# Altium schematic sheet AudioSubsystem.SchDoc: Audio Subsystem
size Letter; DocumentNumber: 4; Revision: 1; SheetNumber: 4; SheetTotal: 6
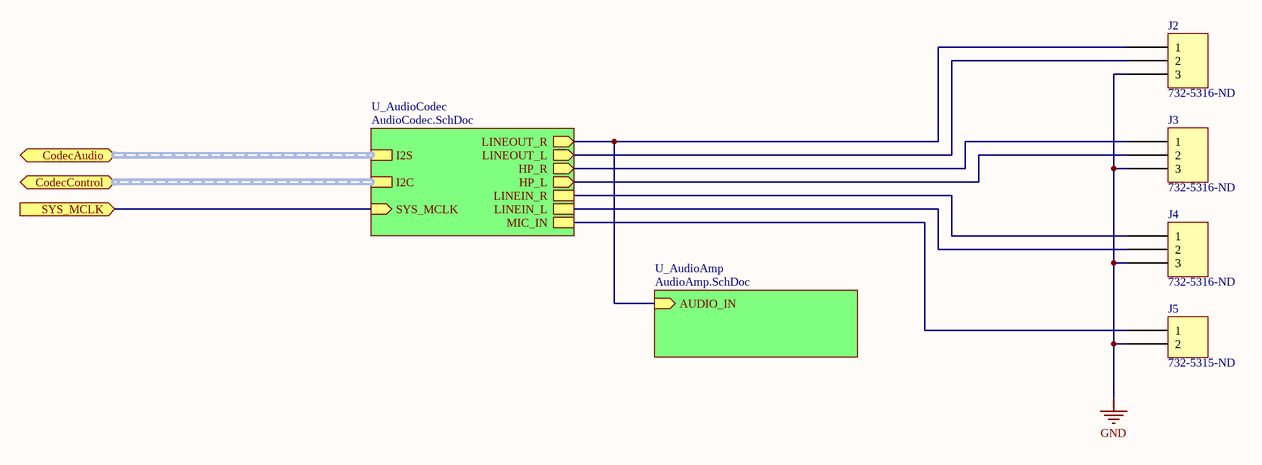
[diagram p0: AudioSubsystem.SchDoc]

## Parts
J2  Supplier Part Number 1: 732-5316-ND  [Pinhead_1x3]  (hidden comment: Header)
J3  Supplier Part Number 1: 732-5316-ND  [Pinhead_1x3]  (hidden comment: Header)
J4  Supplier Part Number 1: 732-5316-ND  [Pinhead_1x3]  (hidden comment: Header)
J5  Supplier Part Number 1: 732-5315-ND  [Pinhead_1x2]  (hidden comment: 2 Pin)

## Sub-sheets
U_AudioAmp = AudioAmp.SchDoc: AUDIO_IN (in)
U_AudioCodec = AudioCodec.SchDoc: LINEIN_L, LINEIN_R, LINEOUT_R (out), LINEOUT_L (out), HP_R (out), HP_L (out), MIC_IN, I2S (harness I2S), SYS_MCLK (in), I2C (harness I2C)

## Ports
CodecAudio (harness I2S), CodecControl (harness I2C), SYS_MCLK (in)

## Nets
GND: J2.3 J3.3 J4.3 J5.2
SYS_MCLK: port SYS_MCLK, sheet U_AudioCodec/SYS_MCLK
NetJ2_1: J2.1 ; sheet U_AudioAmp/AUDIO_IN, sheet U_AudioCodec/LINEOUT_R
NetJ2_2: J2.2 ; sheet U_AudioCodec/LINEOUT_L
NetJ3_1: J3.1 ; sheet U_AudioCodec/HP_R
NetJ3_2: J3.2 ; sheet U_AudioCodec/HP_L
NetJ4_1: J4.1 ; sheet U_AudioCodec/LINEIN_R
NetJ4_2: J4.2 ; sheet U_AudioCodec/LINEIN_L
NetJ5_1: J5.1 ; sheet U_AudioCodec/MIC_IN

## Buses and harness runs
harness port CodecAudio = sheet U_AudioCodec/I2S
harness port CodecControl = sheet U_AudioCodec/I2C

## Notes on the sheet
- Title
- Size:
- Date:
- Letter
- Number:
- Time:
- Revision:
- Sheet
- of
- File:

## Library data of the parts
J2-J4 = 3 Pin: Supplier 1: Digi-Key
J5 = 2 Pin: Supplier 1: Digi-Key